# Altium project raptorv0.PrjPCB
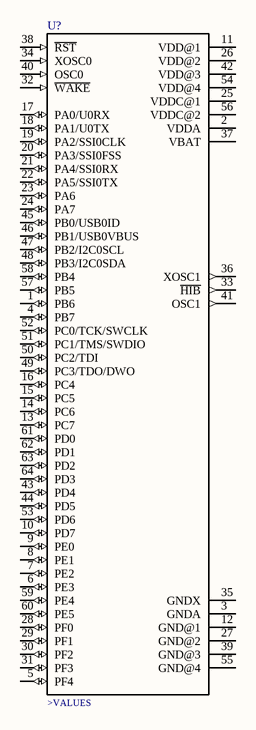
[diagram p0: microcontroller.SchDoc]
1 sheet, 1 parts. Net scope: global (net labels, ports and power ports of the same name join across sheets).

## Sheet microcontroller.SchDoc
size Letter

### Parts
U?  TM4C123GH6PMI  [*QFP50P1200X1200X160-64N]  (value not drawn)

### Nets

Not connected (* = marked no-connect by the designer): U? 1(PB6) 2(VDDA) 3(GNDA) 4(PB7) 5(PF4) 6(PE3) 7(PE2) 8(PE1) 9(PE0) 10(PD7) 11(VDD@1) 12(GND@1) 13(PC7) 14(PC6) 15(PC5) 16(PC4) 17(PA0/U0RX) 18(PA1/U0TX) 19(PA2/SSI0CLK) 20(PA3/SSI0FSS) 21(PA4/SSI0RX) 22(PA5/SSI0TX) 23(PA6) 24(PA7) 25(VDDC@1) 26(VDD@2) 27(GND@2) 28(PF0) 29(PF1) 30(PF2) 31(PF3) 32(~{WAKE}) 33(~{HIB}) 34(XOSC0) 35(GNDX) 36(XOSC1) 37(VBAT) 38(~{RST}) 39(GND@3) 40(OSC0) 41(OSC1) 42(VDD@3) 43(PD4) 44(PD5) 45(PB0/USB0ID) 46(PB1/USB0VBUS) 47(PB2/I2C0SCL) 48(PB3/I2C0SDA) 49(PC3/TDO/DWO) 50(PC2/TDI) 51(PC1/TMS/SWDIO) 52(PC0/TCK/SWCLK) 53(PD6) 54(VDD@4) 55(GND@4) 56(VDDC@2) 57(PB5) 58(PB4) 59(PE4) 60(PE5) 61(PD0) 62(PD1) 63(PD2) 64(PD3)

### Notes on the sheet
- (in symbol TM4C123GH6PMI) >VALUES

### Library data of the parts
U? = TM4C123GH6PMI: MCU 32-Bit Tiva C ARM Cortex M4F RISC 256KB Flash 1.2V/3.3V 64-Pin LQFP Tray/Tube; MF: Texas Instruments; SnapEDA_Link: https://www.snapeda.com/parts/TM4C123GH6PMI/Texas%20Instruments/view-part/?ref=snap; Availability: Unavailable; Price: None; MP: TM4C123GH6PMI; Package: LQFP-64 Texas Instruments; Value: *